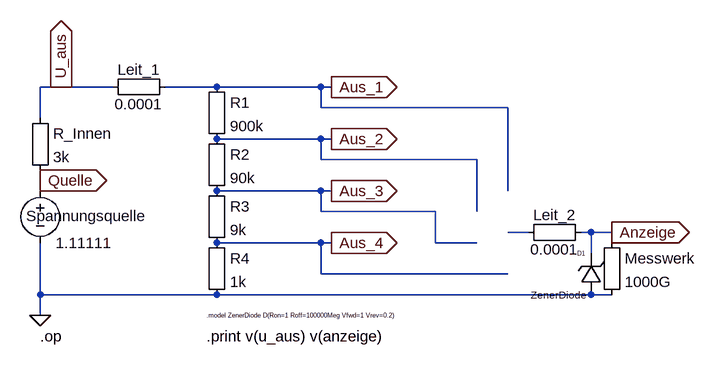
[diagram p0: schematic V1 Spannungsmesser.asc]
V1 Spannungsmesser.asc, the LTspice schematic file:
Version 4
SHEET 1 920 680
WIRE -128 16 -160 16
WIRE -48 16 -128 16
WIRE 112 16 32 16
WIRE 272 16 112 16
WIRE 288 16 272 16
WIRE 272 48 272 16
WIRE 560 48 272 48
WIRE -160 64 -160 16
WIRE 272 96 112 96
WIRE 288 96 272 96
WIRE 272 128 272 96
WIRE 512 128 272 128
WIRE -160 160 -160 144
WIRE -160 176 -160 160
WIRE 272 176 112 176
WIRE 288 176 272 176
WIRE 560 176 560 48
WIRE 272 208 272 176
WIRE 448 208 272 208
WIRE 512 208 512 128
WIRE 592 240 560 240
WIRE 688 240 672 240
WIRE 720 240 688 240
WIRE 272 256 112 256
WIRE 288 256 272 256
WIRE 448 256 448 208
WIRE 512 256 448 256
WIRE 720 256 720 240
WIRE 688 272 688 240
WIRE 272 304 272 256
WIRE 560 304 272 304
WIRE -160 336 -160 256
WIRE 112 336 -160 336
WIRE 688 336 112 336
WIRE 720 336 688 336
WIRE -160 368 -160 336
FLAG -160 368 0
FLAG 288 16 Aus_1
IOPIN 288 16 Out
FLAG 288 96 Aus_2
IOPIN 288 96 Out
FLAG 288 176 Aus_3
IOPIN 288 176 Out
FLAG 288 256 Aus_4
IOPIN 288 256 Out
FLAG -160 160 Quelle
IOPIN -160 160 Out
FLAG 720 240 Anzeige
IOPIN 720 240 Out
FLAG -128 16 U_aus
IOPIN -128 16 Out
SYMBOL voltage -160 160 R0
WINDOW 0 -22 55 Left 2
SYMATTR InstName Spannungsquelle
SYMATTR Value 1.11111
SYMBOL Misc\\EuropeanResistor 96 0 R0
SYMATTR InstName R1
SYMATTR Value 900k
SYMBOL Misc\\EuropeanResistor 96 80 R0
SYMATTR InstName R2
SYMATTR Value 90k
SYMBOL Misc\\EuropeanResistor 96 160 R0
SYMATTR InstName R3
SYMATTR Value 9k
SYMBOL Misc\\EuropeanResistor 96 240 R0
SYMATTR InstName R4
SYMATTR Value 1k
SYMBOL Misc\\EuropeanResistor -176 48 R0
SYMATTR InstName R_Innen
SYMATTR Value 3k
SYMBOL Misc\\EuropeanResistor 704 240 R0
SYMATTR InstName Messwerk
SYMATTR Value 1000G
SYMBOL Misc\\EuropeanResistor 48 0 R90
WINDOW 0 5 56 VBottom 2
WINDOW 3 27 56 VTop 2
SYMATTR InstName Leit_1
SYMATTR Value 0.0001
SYMBOL Misc\\EuropeanResistor 688 224 R90
WINDOW 0 5 56 VBottom 2
WINDOW 3 27 56 VTop 2
SYMATTR InstName Leit_2
SYMATTR Value 0.0001
SYMBOL zener 704 336 R180
WINDOW 0 24 64 Left 0
WINDOW 3 24 0 Left 1
SYMATTR InstName D1
SYMATTR Value ZenerDiode
TEXT -160 400 Left 2 !.op
TEXT 96 400 Left 2 !.print v(u_aus) v(anzeige)
TEXT 96 368 Left 0 !.model ZenerDiode D(Ron=1 Roff=100000Meg Vfwd=1 Vrev=0.2)

The netlist it stands for:
* V1 Spannungsmesser.asc
V§Spannungsquelle Quelle 0 1.11111
R1 Aus_1 Aus_2 900k
R2 Aus_2 Aus_3 90k
R3 Aus_3 Aus_4 9k
R4 Aus_4 0 1k
R_Innen U_aus Quelle 3k
R§Messwerk Anzeige 0 1000G
R§Leit_1 Aus_1 U_aus 0.0001
R§Leit_2 Anzeige N001 0.0001
D1 0 Anzeige ZenerDiode
.model D D
.lib standard.dio
.op
.print v(u_aus) v(anzeige)
.model ZenerDiode D(Ron=1 Roff=100000Meg Vfwd=1 Vrev=0.2)
.backanno
.end